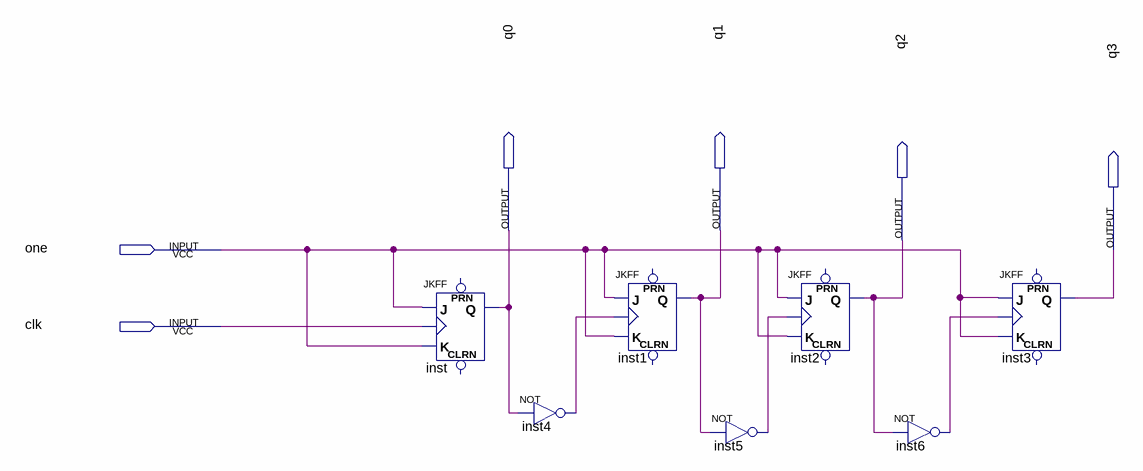
[diagram p0: schematic sheet]
// Quartus schematic contador4bits.bdf as structural Verilog: 7 symbols, 6 pins
module contador4bits (
  input  one,
  input  clk,
  output q0,
  output q1,
  output q2,
  output q3
);

  wire inst4_out, inst5_out, inst6_out;

  JKFF inst (.K(one), .J(one), .CLK(clk), .Q(q0));  // open: PRN, CLRN
  not inst4 (inst4_out, q0);
  JKFF inst1 (.K(one), .J(one), .CLK(inst4_out), .Q(q1));  // open: PRN, CLRN
  not inst5 (inst5_out, q1);
  JKFF inst2 (.K(one), .J(one), .CLK(inst5_out), .Q(q2));  // open: PRN, CLRN
  not inst6 (inst6_out, q2);
  JKFF inst3 (.K(one), .J(one), .CLK(inst6_out), .Q(q3));  // open: PRN, CLRN
endmodule
